# EAGLE schematic Triac (EAGLE 8.4.0)
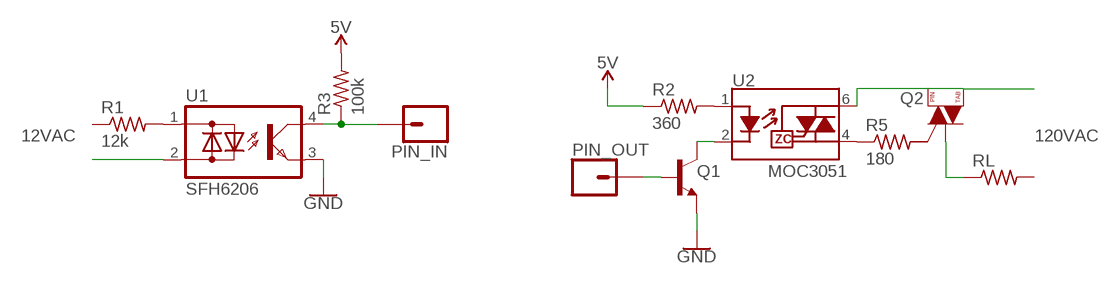
[diagram p0: schematic, sheet 1]

## Parts
PIN_IN  CONN_01  [1X01]
PIN_OUT  CONN_01  [1X01]
Q1  TRANS_NPN-MMBTA42  [SOT23-3]
Q2  BT137-600E  TRIAC-Z0103MN  [SOT223]
R1  12k  R-US_R0603  [R0603]
R2  360  R-US_R0603  [R0603]
R3  100k  R-US_R0603  [R0603]
R5  180  R-US_R0603  [R0603]
RL  R-US_R0603  [R0603]
U1  SFH6206  [DIL4-SMD]
U2  TRIAC_OPTOCOUPLER-MOC3063SM  [DIP8SMD]

## Nets
5V: R2.1 R3.2
GND: Q1.2(E) U1.3(E)
N$1: R1.2 U1.1(AC1)
N$2: PIN_IN.1 R3.1 U1.4(C)
N$3: R2.2 U2.1(A)
N$4: R5.1 U2.4(T2)
N$5: Q2.2(T2) Q2.4(T2) U2.6(T1)
N$6: U1.2(AC2)
N$7: Q1.3(C) U2.2(K)
N$8: PIN_OUT.1 Q1.1(B)
N$9: Q2.1(T1) RL.1
Unconnected: Q2.3(G) R1.1 R5.2 RL.2

## Notes on the sheet
- 12VAC | 120VAC
- MOC3051

## Library data of the parts
PIN_IN PIN_OUT = SparkFun-Connectors:CONN_01: Single connection point. Often used as Generic Header-pin footprint for 0.1 inch spaced/style header connections On any of the 0.1 inch spaced packages, you can populate with these: Break Away Headers - Straight <https://www.sparkfun.com/products/116> (PRT-00116) Break Away Male Headers - Right Angle <https://www.sparkfun.com/products/553> (PRT-00553) Female Headers <https://www.sparkfun.com/products/115> (PRT-00115) Break Away Headers - Machine Pin <https://www.sparkfun.com/products/117> (PRT-00117) Break Away Female Headers - Swiss Machine Pin <https://www.sparkfun.com/products/743> (PRT-00743) This device is also useful as a general connection point to wire up your design to another part of your project. Our various solder wires solder well into these plated through hole pads. Hook-Up Wire - Assortment (Stranded, 22 AWG) <https://www.sparkfun.com/products/11375> (PRT-11375) Hook-Up Wire - Assortment (Solid Core, 22 AWG) <https://www.sparkfun.com/products/11367> (PRT-11367) View the entire wire category on our website here <https://www.sparkfun.com/categories/141> Special notes: SMTSO-256-ET is a "flush mount" nut for a 4-40 screw. We mostly use this on specialty testbeds; it is a nice way to connect hardware to your PCB at an adjustable hieght. Also note, the SNAP packages are for using a snappable style connector. We sell a baggie of snaps and they are also used on two LilyPad designs: Snap Assortment - 30 pack (male and female) <https://www.sparkfun.com/products/11347> (DEV-11347) LilyPad Arduino SimpleSnap <https://www.sparkfun.com/products/10941> (DEV-10941) LilyPad SimpleSnap Protoboard <https://www.sparkfun.com/products/10940> (DEV-10940)
Q1 = SparkFun-DiscreteSemi:TRANS_NPN: NPN transistor Current controlled devices typically used to amplify current or used as a switch. BC547 - COM-08928 <http://www.sparkfun.com/products/8928> (TO-92 45V 100mA) (1.Collector 2.Base 3.Emitter) 2N3904 - COM-00521 <http://www.sparkfun.com/products/521> (TO-92 40V 200mA) (1.Emitter 2.Base 3.Collector) P2N2222A - COM-12852 <http://www.sparkfun.com/products/12852> (TO-92 40V 600mA) (1.Collector 2.Base 3.Emitter); PROD_ID: TRANS-09116; VALUE: 500mA/300V
Q2 = SparkFun-DiscreteSemi:TRIAC: Bidirectional triode thyristor (TRIAC) Four quadrant TRIAC. Useful for EL Wire Applications Link to datasheet <https://cdn.sparkfun.com/datasheets/Components/EL/EL_Escudo_Dos/Z0103MN.pdf> SparkFun Products: SparkFun EL Sequencer <https://www.sparkfun.com/products/12781> SparkFun EL Escudo Dos <https://www.sparkfun.com/products/10878>; PROD_ID: TRANS-09120; VALUE: 1A/600V
R1-R3 R5 RL = adafruit:R-US_: RESISTOR, American symbol
U1 = optocoupler:SFH620: Optocoupler, Phototransistor Output, AC Input Source: http://www.vishay.com/docs/83675/sfh620.pdf; MF: VISHAY/TELEFUNKEN; MPN: SFH6206-3; OC_FARNELL: 1469585; OC_NEWARK: 58K2214
U2 = SparkFun-DiscreteSemi:TRIAC_OPTOCOUPLER: Zero-cross Triac Driver Optocoupler SImplifies logic control of 115/240 VAC power. Zero voltage crossing to minimize conducted and radiated line noise. Link to datasheet <http://www.mouser.com/ds/2/149/MOC3063M-196324.pdf> Emitter: VF: 1.3V IFT: 5 mA Detector: VDRM: 600V ITSM: 1A VISO: 4170V DV⁄dt: 1500V⁄µs SparkFun Products: SparkFun EL Sequencer <https://www.sparkfun.com/products/12781> SparkFun EL Escudo Dos <https://www.sparkfun.com/products/10878>; PROD_ID: IC-10683